# EAGLE design cheapboard1.0 (EAGLE 6.2)
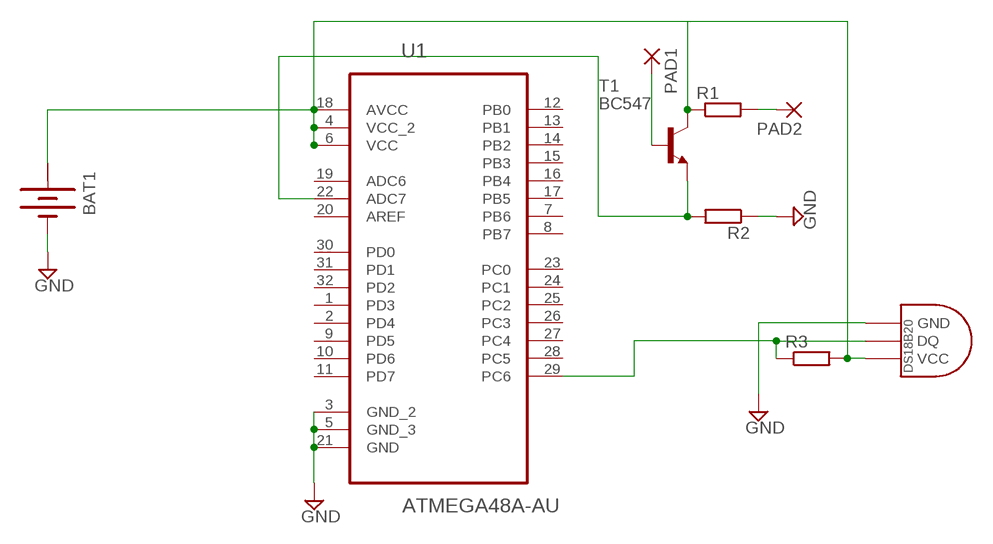
[diagram p0: schematic, sheet 1]

## Parts
BAT1  BATTERY  [BATTERY]
PAD1  SMD5  [SMD2,54-5,08]
PAD2  SMD5  [SMD2,54-5,08]
R1  R-EU_M0805  [M0805]
R2  R-EU_M0805  [M0805]
R3  R-EU_M0805  [M0805]
T1  BC547  [TO92]
U1  ATMEGA48A-AU  [QFP80P900X900X120-32N]
U$1  DS1820SOIC  [DS18B20_SOIC]

## Nets
GND: BAT1.- R2.1 U1.3(GND_2) U1.5(GND_3) U1.21(GND) U$1.GND
N$1: BAT1.+ R1.1 R3.2 T1.3(C) U1.4(VCC_2) U1.6(VCC) U1.18(AVCC) U$1.VCC
N$3: R2.2 T1.1(E) U1.22(ADC7)
N$6: R3.1 U1.29(PC6) U$1.DQ
PAD1: PAD1.1(P) T1.2(B)
PAD2: PAD2.1(P) R1.2
Unconnected: U1.1(PD3) U1.2(PD4) U1.7(PB6) U1.8(PB7) U1.9(PD5) U1.10(PD6) U1.11(PD7) U1.12(PB0) U1.13(PB1) U1.14(PB2) U1.15(PB3) U1.16(PB4) U1.17(PB5) U1.19(ADC6) U1.20(AREF) U1.23(PC0) U1.24(PC1) U1.25(PC2) U1.26(PC3) U1.27(PC4) U1.28(PC5) U1.30(PD0) U1.31(PD1) U1.32(PD2)

## Power pins joined to a net without a drawn wire
+: BAT1.+@1(+)

## Library data of the parts
BAT1 = special:BATTERY: BATTERY
PAD1 PAD2 = wirepad:SMD5: SMD PAD
R1-R3 = rcl:R-EU_: RESISTOR, European symbol
T1 = transistor:BC547: NPN TRANSISTOR
U1 = Atmel_By_element14_Batch_1:ATMEGA48A-AU: MCU; DESCRIPTION: MCU; MPN: ATMEGA48A-AU; OC_FARNELL: 1841612; OC_NEWARK: 12T1301; PACKAGE: QFP-32; SUPPLIER: Atmel
U$1 = Ava:DS1820: DS18B20 Programmable Resolution 1-Wire Digital Thermometer Description The DS18B20 digital thermometer provides 9-bit to 12-bit Celsius temperature measurements and has an alarm function with nonvolatile user-programmable upper and lower trigger points. The DS18B20 communicates over a 1-Wire® bus that by definition requires only one data line (and ground) for communication with a central microprocessor. It has an operating temperature range of -55°C to +125°C and is accurate to ±0.5°C over the range of -10°C to +85°C. In addition, the DS18B20 can derive power directly from the data line ("parasite power"), eliminating the need for an external power supply. Each DS18B20 has a unique 64-bit serial code, which allows multiple DS18B20s to function on the same 1-Wire bus. Thus, it is simple to use one microprocessor to control many DS18B20s distributed over a large area. Applications that can benefit from this feature include HVAC environmental controls, temperature monitoring systems inside buildings, equipment, or machinery, and process monitoring and control systems.

## Board
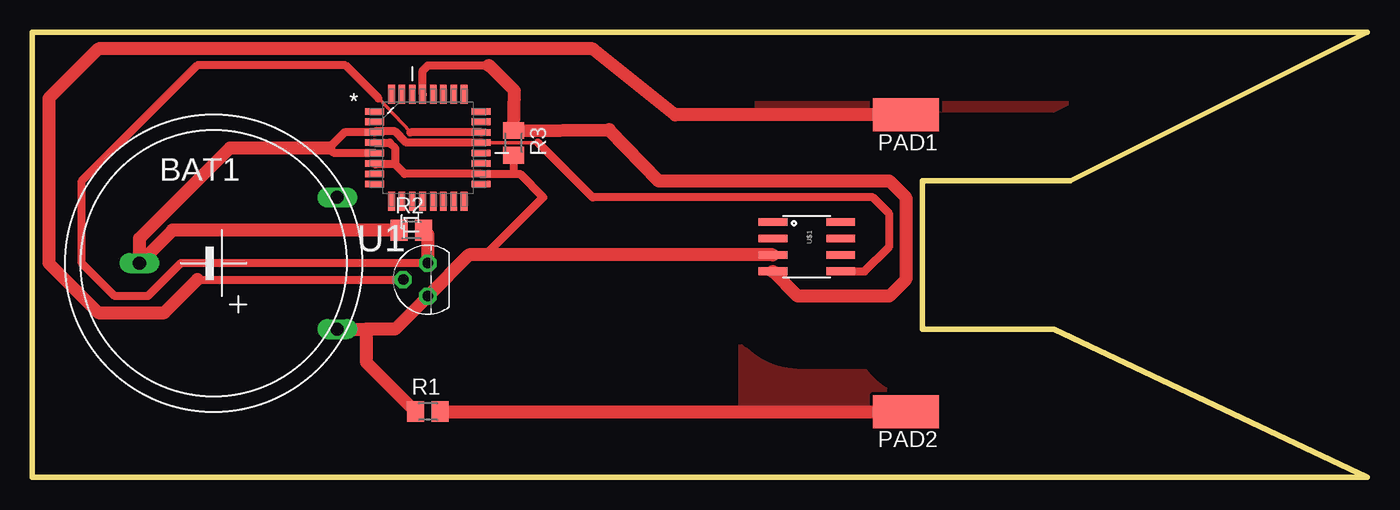
[diagram p1: board, top side]

Size 102.87 x 34.29 mm. Coordinates in mm from the lower left corner, seen from the top.
Outline: 0,0 102.87,0 78.74,11.43 68.58,11.43 68.58,22.86 80.01,22.86 102.87,34.29 0,34.29 0,0
Copper layers (1*16): Top 0.035mm / dielectric 1.5mm / Bottom 0.035mm
Design rules: minimum track width 10mil, minimum drill 24mil, track to track 8mil, track to pad 8mil, pad to pad 8mil, via to via 8mil, smd to smd 8mil, copper to edge 40mil, drill to drill 8mil, minimum pad ring 10mil, minimum via ring 8mil, stop-mask expansion 4mil, vias tented up to drill 0mil, thermal gap 10mil

### Footprints (pad centres in the part's own frame; a part is rotated, then mirrored left to right if it is on the bottom)
BATTERY = drill 1.016 long: + 9.525,-5.08; +@1 9.525,5.08; - -5.715,0
SMD2,54-5,08 = smd 2.54 x 5.08: 1 0,0
M0805 = smd 1.3 x 1.6: 1 -0.95,0; 2 0.95,0
TO92 = drill 0.813 octagon: 1 1.27,0; 2 0,1.905; 3 -1.27,0
QFP80P900X900X120-32N = smd 1.473 x 0.508: 1 -4.115,2.794; 2 -4.115,2.007; 3 -4.115,1.194; 4 -4.115,0.406; 5 -4.115,-0.406; 6 -4.115,-1.194; 7 -4.115,-2.007; 8 -4.115,-2.794; 17 4.115,-2.794; 18 4.115,-2.007; 19 4.115,-1.194; 20 4.115,-0.406; 21 4.115,0.406; 22 4.115,1.194; 23 4.115,2.007; 24 4.115,2.794 | smd 0.508 x 1.473: 9 -2.794,-4.115; 10 -2.007,-4.115; 11 -1.194,-4.115; 12 -0.406,-4.115; 13 0.406,-4.115; 14 1.194,-4.115; 15 2.007,-4.115; 16 2.794,-4.115; 25 2.794,4.115; 26 2.007,4.115; 27 1.194,4.115; 28 0.406,4.115; 29 -0.406,4.115; 30 -1.194,4.115; 31 -2.007,4.115; 32 -2.794,4.115
DS18B20_SOIC = smd 0.61 x 2.21: DQ 1.905,-2.616; GND 1.905,2.616; NC -1.905,-2.616; NC2 -0.635,-2.616; NC3 -1.905,2.616; NC4 -0.635,2.616; NC5 0.635,2.616; VCC 0.635,-2.616

### Placement (x,y rotation side)
BAT1  13.97,16.51 0 top
PAD1  67.31,27.94 90 top
PAD2  67.31,5.08 90 top
R1  30.48,5.08 0 top
R2  29.21,19.05 0 top
R3  37.08,25.78 270 top
T1  30.48,15.24 90 top
U1  30.48,25.4 0 top
U$1  59.69,17.78 270 top

### Tracks (layer width: path | path; a pad name or v marks a point on that pad's centre or on a via)
GND
  Top 0.254: U1.21 38.96,25.81
  Top 0.61: U1.5 23.27,24.99 22.86,25.4 24.05,26.59 U1.3 26.44,26.67 27.94,26.67 28.8,25.81 U1.21 | U$1.GND 64.14,15.88 66.04,17.78 66.04,20.32 64.77,21.59 43.18,21.59 40.01,24.77 39.37,25.4 38.96,25.81
  Top 1.016: R2.1 10.79,19.05 BAT1.- 8.26,18.41 15.24,25.4 22.86,25.4
N$1
  Top 0.61: 27.94,24.13 28.68,23.39 U1.18 37.21,23.39 | 27.94,24.13 26.44,24.13 U1.6 | 33.66,17.14 34.92,17.14 39.37,21.59 37.57,23.39 37.21,23.39 | U1.4 27.53,25.81 27.94,25.4 27.94,24.13 | R3.2 37.08,23.52 37.21,23.39
  Top 1.016: BAT1.+ 25.72,11.43 | U$1.VCC 33.66,17.14 T1.3 27.94,11.43 25.72,11.43 | 25.72,11.43 25.72,8.89 R1.1
N$3
  Top 0.254: 29.13,26.59 26.67,29.21
  Top 0.61: T1.1 11.43,16.51 8.89,13.97 6.35,13.97 3.81,16.51 3.81,22.86 12.7,31.75 24.13,31.75 26.67,29.21 | U1.22 29.13,26.59
  Top 1.016: T1.1 30.48,18.73 R2.2
N$6
  Top 0.61: U1.29 30.07,31.34 30.48,31.75 35.18,31.75
  Top 1.016: U$1.DQ 58.98,13.97 66.04,13.97 67.31,15.24 67.31,21.59 66.04,22.86 48.26,22.86 44.45,26.8 R3.1 37.15,29.78 35.18,31.75
PAD1
  Top 0.61: 12.7,15.24 T1.2
  Top 1.016: PAD1.1 49.53,27.94 43.18,33.02 5.08,33.02 1.27,29.21 1.27,16.51 5.08,12.7 10.16,12.7 12.7,15.24
  pour Top (isolate 5.08): 99.06,33.02 55.88,33.02 55.88,24.13 81.28,24.13
PAD2
  Top 1.016: R1.2 PAD2.1
  pour Top (isolate 5.08): 80.01,10.16 54.61,10.16 54.61,1.27 99.06,1.27